# Altium schematic sheet Sheet1.SchDoc
size A; SheetNumber: 1; SheetTotal: 1
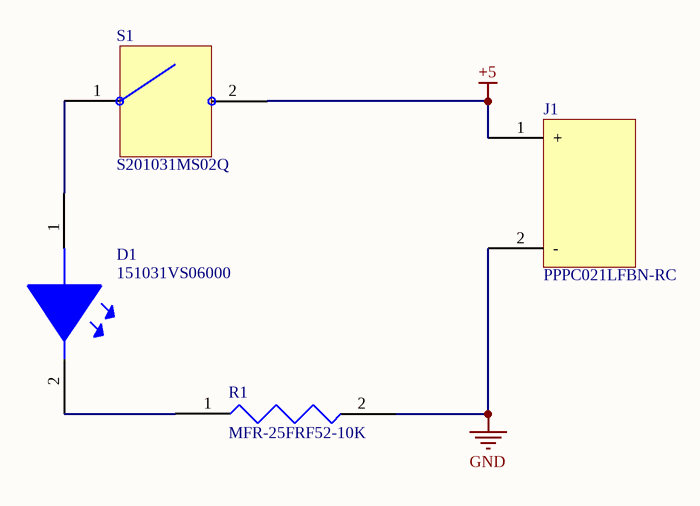
[diagram p0: Sheet1.SchDoc]

## Parts
D1  151031VS06000  [LED]
J1  PPPC021LFBN-RC  [HEAD]
R1  MFR-25FRF52-10K  [RES]
S1  S201031MS02Q  [SW_S101031MS02Q]

## Nets
+5: J1.1(+) S1.2
GND: J1.2(-) R1.2
NetD1_1: D1.1 S1.1
NetD1_2: D1.2 R1.1

## Library data of the parts
D1 = 151031VS06000: Single Color LED, Bright Green, Diffused, T-1, 3mm; Manufacturer: Wurth Electronics; Shape: Round; Forward Current: 30mA; Luminous Intensity-Nom: 30mcd; Channels: 1; Viewing Angle: 60°; Overall Height: 5.3mm; Supplier: Rs; Supplier Part Number: 8154388P; Manufacturer Part Number: 151031VS06000; RoHS: Yes; Category: LEDs; Stock: 2549; Pricing: 200=0.098, 500=0.085, 1000=0.08, 2000=0.076 (GBP); Mounting Technology: Radial; Pins: 2; Color: Green; Min Operating Temperature: -40°C; Max Operating Temperature: 85°C; Lens Style: Diffused; Optoelectronic Device Type: SINGLE COLOR LED; Packaging: Bulk; T-code: T-1; Size: 3mm; Terminal Pitch: 2.54mm; Reach SVHC Compliant: Yes; RoHS Compliant: Yes; ComponentLink1URL: https://datasheet.ciiva.com:443/pdfs/VipMasterIC/IC/MIDC/MIDC-S-A0001524573/MIDC-S-A0001524573-1.pdf?src-supplier=IHS+Markit; ComponentLink1Description: https://datasheet.ciiva.com:443/pdfs/VipMasterIC/IC/MIDC/MIDC-S-A0001524573/MIDC-S-A0001524573-1.pdf?src-supplier=IHS+Markit; ComponentLink2URL: https://datasheet.ciiva.com/22657/151031vs06000-22657015.pdf?src-supplier=Element14; ComponentLink2Description: https://datasheet.ciiva.com/22657/151031vs06000-22657015.pdf?src-supplier=Element14; ComponentLink3URL: https://datasheet.ciiva.com/29363/759487-da-01-en-tht-led-3mm-b-gruen-151031vs06000-29363829.pdf?src-supplier=Conrad; ComponentLink3Description: https://datasheet.ciiva.com/29363/759487-da-01-en-tht-led-3mm-b-gruen-151031vs06000-29363829.pdf?src-supplier=Conrad
J1 = PPPC021LFBN-RC: Board Connector, 2 Contact(s), 1 Row(s), Female, Straight, 0.1 inch Pitch, Solder Terminal, Locking; Manufacturer: Sullins; Manufacturer Series: PP; Contact Pattern: RECTANGULAR; Contact Style: SQ PIN-SKT; Number Of Connectors: 1; Polarization Key: POLARIZED HOUSING; Rated Current (Signal): 3A; Number of Contacts: 2; Body Breadth: 0.094inch; Body Depth: 0.334inch; Body Length: 0.22inch; Reference Standard: UL; Reliability: COMMERCIAL; Supplier: Digikey; Supplier Part Number: S7035-ND; Manufacturer Part Number: PPPC021LFBN-RC; RoHS: Yes; Category: Connectors; Stock: 20345; Pricing: 1=0.34, 10=0.287, 100=0.223, 500=0.1911, 1000=0.15925, 5000=0.1365, 10000=0.13 (USD); Mounting Technology: Board; Contact Material: Bronze; Contact Finish - Mating: AU; Insulation Material: Polyester; Connector Type: BOARD CONNECTOR; Contact Gender: Female; Mounting Style: STRAIGHT; Number Of PCB Rows: 1; Number of Rows Loaded: 1; PCB Contact Pattern: RECTANGULAR; Termination: Solder; Mating Contact Pitch: 0.1inch; Mounting Option 1: LOCKING; Terminal Length: 0.125inch; Terminal Pitch: 2.54mm; Reach SVHC Compliant: Yes; RoHS Compliant: Yes; ComponentLink1URL: https://datasheet.ciiva.com:443/pdfs/VipMasterIC/IC/SUCS/SUCSS00270/SUCSS00270-1.pdf?src-supplier=IHS+Markit; ComponentLink1Description: https://datasheet.ciiva.com:443/pdfs/VipMasterIC/IC/SUCS/SUCSS00270/SUCSS00270-1.pdf?src-supplier=IHS+Markit; ComponentLink2URL: https://media.digikey.com/pdf/Data%20Sheets/Sullins%20PDFs/Female_Headers.100_DS.pdf?src-supplier=Digikey; ComponentLink2Description: https://media.digikey.com/pdf/Data%20Sheets/Sullins%20PDFs/Female_Headers.100_DS.pdf?src-supplier=Digikey; ComponentLink3URL: http://www.sullinscorp.com/catalogs/78_Page80-81_HEADER_.100_2.54mm_FEMALE.pdf?src-supplier=Future+Electronics; ComponentLink3Description: http://www.sullinscorp.com/catalogs/78_Page80-81_HEADER_.100_2.54mm_FEMALE.pdf?src-supplier=Future+Electronics; ComponentLink4URL: https://datasheet.octopart.com/PPPC021LFBN-RC-Sullins-datasheet-41308905.pdf?src-supplier=Future+Electronics; ComponentLink4Description: https://datasheet.octopart.com/PPPC021LFBN-RC-Sullins-datasheet-41308905.pdf?src-supplier=Future+Electronics
R1 = MFR-25FRF52-10K: Fixed Resistor, Metal Film, 0.25W, 10000ohm, 250V, 1% +/-Tol, 100ppm/Cel, Through Hole Mount; Manufacturer: Yageo; Power: 250mW; Rated Temperature: 70°C; Value: 10kR; Temperature Coefficient: 100ppm/°C; Lead Diameter: 0.55mm; Lead Length: 28mm; Package Diameter: 2.4mm; Package Length: 6.3mm; Supplier: Future Electronics; Supplier Part Number: 3739323; Manufacturer Part Number: MFR-25FRF52-10K; RoHS: Yes; Category: Through-Hole Resistors; Stock: 195000; Pricing: 5000=0.0088, 20000=0.0085, 50000=0.0083, 125000=0.0081, 200000=0.0078 (USD); Mounting Technology: Through Hole; Pins: 2; Package Shape: Tubular; Terminal Finish: Tin; Min Operating Temperature: -55°C; Max Operating Temperature: 155°C; Tolerance: 1%; JESD-609 Code: e3; Resistor Type: FIXED RESISTOR; Construction: Cylindrical; Package Style: AxialMeter; Packaging: Tape and Reel; Technology: METAL FILM; Termination: Wire; Working Voltage: 250V; Reach SVHC Compliant: Yes; RoHS Compliant: Yes; ComponentLink1URL: https://datasheet.ciiva.com:443/pdfs/VipMasterIC/IC/YAGO/YAGO-S-A0009358480/YAGO-S-A0009358480-1.pdf?src-supplier=IHS+Markit; ComponentLink1Description: https://datasheet.ciiva.com:443/pdfs/VipMasterIC/IC/YAGO/YAGO-S-A0009358480/YAGO-S-A0009358480-1.pdf?src-supplier=IHS+Markit; ComponentLink2URL: https://datasheet.ciiva.com/25645/yageolr-mfr-2013-25645549.pdf?src-supplier=Digikey; ComponentLink2Description: https://datasheet.ciiva.com/25645/yageolr-mfr-2013-25645549.pdf?src-supplier=Digikey
S1 = S201031MS02Q: Slide Switch, 4 Positions, DPST, Latched, 1A, 125VDC, 6 PCB Hole Cnt, Solder Terminal, Through Hole-straight; Manufacturer: ITT C&K; Manufacturer Series: S; Actuator Material: Nylon; End Contact Plating: Silver; Actuator Color: Black; Actuator Finish: Matte; End Contact Material: Copper; Actuator Type: HIGH TYPE; Contact AC Max Rating R Load: 6A@250VAC; Contact Current(AC)-Max: 6A; Contact DC Max Rating R Load: 1A@125VDC; Contact Voltage(AC)-Max: 250V; Contact Voltage(DC)-Max: 125V; Electrical Life: 10000Cycles; Contact Resistance: 0.01mR; Dielectric Withstand Volts: 1000VRMSV; Insulation Resistance: 1GR; Number of Positions: 4; PCB Hole Count: 6; Body Breadth: 13.46inch; Body Height: 7.11mm; Body Length or Diameter: 22.99mm; Actuator Length: 0.335inch; Supplier: Arrow Electronics; Supplier Part Number: S201031MS02Q; Manufacturer Part Number: S201031MS02Q; RoHS: Yes; Category: Slide Switches; Stock: 15; Pricing: 1=1.238 (USD); Mounting Technology: Through Hole; Terminal Finish: Silver; Contact Material: Copper; Center Contact Plating: Silver; Housing Material: Nylon; Terminal Material: Copper; Min Operating Temperature: -30°C; Max Operating Temperature: 65°C; JESD-609 Code: e4; Contact Current(DC)-Max: 1A; Switch Action: LATCHED; Switch Function: DPST; Switch Type: Slide Switch; Termination: Solder; Terminal Length: 0.25inch; Reach SVHC Compliant: Yes; RoHS Compliant: Yes; ComponentLink1URL: https://datasheet.ciiva.com:443/pdfs/VipMasterIC/IC/CKCI/CKCI-S-A0001796527/CKCI-S-A0001796673-1.pdf?src-supplier=IHS+Markit; ComponentLink1Description: https://datasheet.ciiva.com:443/pdfs/VipMasterIC/IC/CKCI/CKCI-S-A0001796527/CKCI-S-A0001796673-1.pdf?src-supplier=IHS+Markit; ComponentLink2URL: https://datasheet.ciiva.com/2889/s-4mar15-2889249.pdf?src-supplier=Digikey; ComponentLink2Description: https://datasheet.ciiva.com/2889/s-4mar15-2889249.pdf?src-supplier=Digikey; ComponentLink3URL: https://datasheet.ciiva.com/8627/s-4mar15-8627420.pdf?src-supplier=Avnet; ComponentLink3Description: https://datasheet.ciiva.com/8627/s-4mar15-8627420.pdf?src-supplier=Avnet; ComponentLink4URL: https://datasheet.ciiva.com/16174/s-30jul14-16174574.pdf?src-supplier=Onlinecomponents.com; ComponentLink4Description: https://datasheet.ciiva.com/16174/s-30jul14-16174574.pdf?src-supplier=Onlinecomponents.com